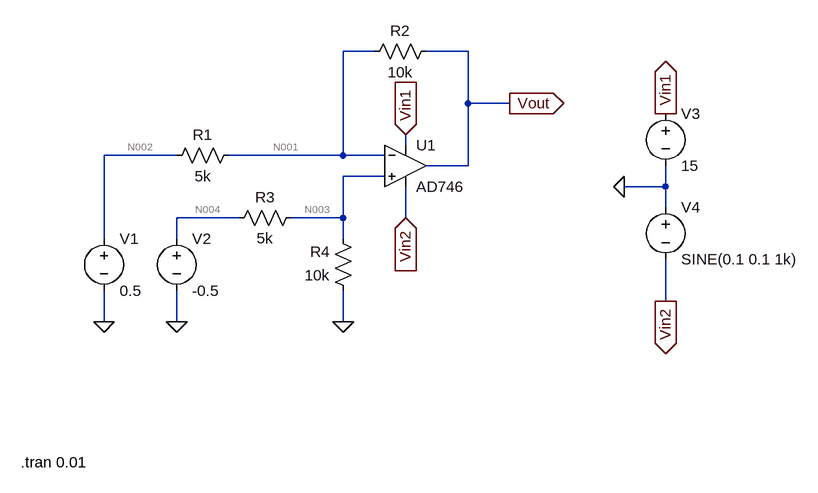
[diagram p0: schematic lab1_1.asc]
lab1_1.asc, the LTspice schematic file:
Version 4
SHEET 1 1016 680
WIRE 336 -64 288 -64
WIRE 480 -64 416 -64
WIRE 480 16 480 -64
WIRE 544 16 480 16
WIRE 384 80 384 64
WIRE 32 96 -80 96
WIRE 288 96 288 -64
WIRE 288 96 112 96
WIRE 352 96 288 96
WIRE 480 112 480 16
WIRE 480 112 416 112
WIRE 352 128 288 128
WIRE 784 144 784 112
WIRE 784 144 720 144
WIRE 784 176 784 144
WIRE 128 192 32 192
WIRE 288 192 288 128
WIRE 288 192 208 192
WIRE 384 192 384 144
WIRE -80 224 -80 96
WIRE 32 224 32 192
WIRE 288 224 288 192
WIRE 784 320 784 256
WIRE -80 352 -80 304
WIRE 32 352 32 304
WIRE 288 352 288 304
FLAG 288 352 0
FLAG 32 352 0
FLAG -80 352 0
FLAG 544 16 Vout
IOPIN 544 16 Out
FLAG 784 32 Vin1
IOPIN 784 32 Out
FLAG 720 144 0
FLAG 784 320 Vin2
IOPIN 784 320 Out
FLAG 384 64 Vin1
IOPIN 384 64 In
FLAG 384 192 Vin2
IOPIN 384 192 In
SYMBOL res 128 80 R90
WINDOW 0 0 56 VBottom 2
WINDOW 3 32 56 VTop 2
SYMATTR InstName R1
SYMATTR Value 5k
SYMBOL res 432 -80 R90
WINDOW 0 0 56 VBottom 2
WINDOW 3 32 56 VTop 2
SYMATTR InstName R2
SYMATTR Value 10k
SYMBOL res 224 176 R90
WINDOW 0 0 56 VBottom 2
WINDOW 3 32 56 VTop 2
SYMATTR InstName R3
SYMATTR Value 5k
SYMBOL res 304 320 R180
WINDOW 0 36 76 Left 2
WINDOW 3 36 40 Left 2
SYMATTR InstName R4
SYMATTR Value 10k
SYMBOL voltage -80 208 R0
WINDOW 123 0 0 Left 0
WINDOW 39 0 0 Left 0
SYMATTR InstName V1
SYMATTR Value 0.5
SYMBOL voltage 32 208 R0
WINDOW 123 0 0 Left 0
WINDOW 39 0 0 Left 0
SYMATTR InstName V2
SYMATTR Value -0.5
SYMBOL Opamps\\AD746 384 48 R0
SYMATTR InstName U1
SYMBOL voltage 784 16 R0
WINDOW 123 0 0 Left 0
WINDOW 39 0 0 Left 0
SYMATTR InstName V3
SYMATTR Value 15
SYMBOL voltage 784 160 R0
WINDOW 123 0 0 Left 0
WINDOW 39 0 0 Left 0
SYMATTR InstName V4
SYMATTR Value SINE(0.1 0.1 1k)
TEXT -208 568 Left 2 !.tran 0.01

The netlist it stands for:
* lab1_1.asc
R1 N001 N002 5k
R2 Vout N001 10k
R3 N003 N004 5k
R4 0 N003 10k
V1 N002 0 0.5
V2 N004 0 -0.5
XU1 N003 N001 Vin1 Vin2 Vout AD746  ; pins In+ In- V+ V- OUT
V3 Vin1 0 15
V4 0 Vin2 SINE(0.1 0.1 1k)
.tran 0.01
.backanno
.end

* Results of the author's LTspice run, read from the files saved beside the schematic
* Operating Point, zero values left out:
*   V(n001) = 710 mV
*   V(n002) = 500 mV
*   V(vout) = 1.13 V
*   V(n003) = -333.3 mV
*   V(n004) = -500 mV
*   V(vin1) = 15 V
*   V(vin2) = -100 mV
*   I(R4) = 33.33 µA
*   I(R3) = 33.33 µA
*   I(R2) = 42 µA
*   I(R1) = 42 µA
*   I(V4) = -4.303 mA
*   I(V3) = -4.345 mA
*   I(V2) = 33.33 µA
*   I(V1) = 42 µA
*   Ix(u1:1) = -351.7 pA
*   Ix(u1:2) = -105.7 pA
*   Ix(u1:3) = 4.345 mA
*   Ix(u1:4) = -4.303 mA
*   Ix(u1:5) = -42 µA
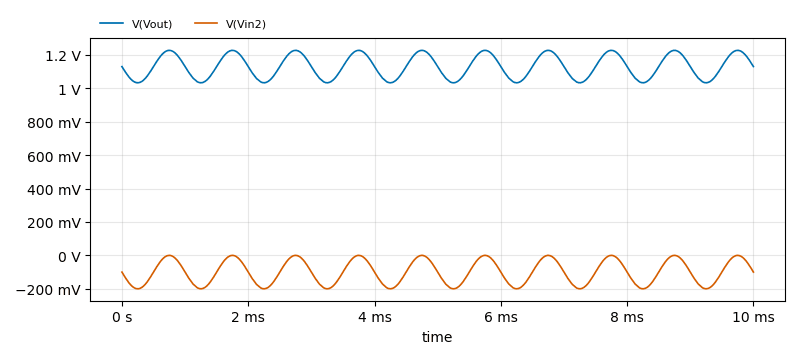
[diagram p1: Transient Analysis of lab1_1.asc, plotted from the saved traces]
* Transient Analysis, 1 run:
*   V(Vout): min 1.033 V, max 1.227 V, average 1.13 V, rms 1.132 V, last 1.13 V
*   V(Vin2): min -200 mV, max -1.501 µV, average -99.81 mV, rms 122.4 mV, last -100 mV